# Altium schematic sheet STM32_SWD.SchDoc
size A4; SheetNumber: 7; SheetTotal: 8
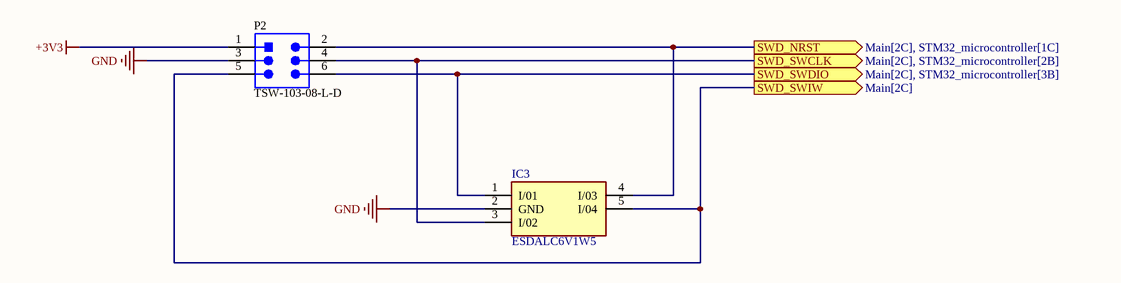
[diagram p0: STM32_SWD.SchDoc]

## Parts
IC3  ESDALC6V1W5  [SOT65P210X110-5N]
P2  TSW-103-08-L-D  [SMTC-TSW-103-08-L-D_V]

## Ports
SWD_NRST (out, see Main[2C], STM32_microcontroller[1C]), SWD_SWCLK (out, see Main[2C], STM32_microcontroller[2B]), SWD_SWDIO (out, see Main[2C], STM32_microcontroller[3B]), SWD_SWIW (out, see Main[2C])

## Nets
+3V3: P2.1
GND: IC3.2(GND) P2.3
SWD_NRST: IC3.4(I/03) P2.2 ; port SWD_NRST
SWD_SWCLK: IC3.3(I/02) P2.4 ; port SWD_SWCLK
SWD_SWDIO: IC3.1(I/01) P2.6 ; port SWD_SWDIO
SWD_SWIW: IC3.5(I/04) P2.5 ; port SWD_SWIW

## Library data of the parts
IC3 = ESDALC6V1W5: Integrated Circuit; Manufacturer_Name: STMicroelectronics; Datasheet Link: http://www.st.com/web/en/resource/technical/document/datasheet/CD00002946.pdf; Height: 1.1mm; Manufacturer_Part_Number: ESDALC6V1W5; Mouser Part Number: 511-ESDALC6V1W5; Mouser Price/Stock: https://www.mouser.co.uk/ProductDetail/STMicroelectronics/ESDALC6V1W5?qs=C%2FEejvvdwQ4xcyFnfrFaDw%3D%3D; Arrow Part Number: ESDALC6V1W5; Arrow Price/Stock: https://www.arrow.com/en/products/esdalc6v1w5/stmicroelectronics?utm_currency=USD&region=nac
P2 = CMP-1024-00336-5: Male Header, Pitch 2.54 mm, 2 x 3 Position, Height 8.38 mm, Tail Length 5.08 mm, -55 to 125 degC, RoHS, Bulk; Manufacturer: Samtec; DatasheetVersion: 04/2012; ComponentLink3URL: http://suddendocs.samtec.com/prints/tsw-xxx-xx-x-x-xx-xxx-footprint.pdf; PackageReference: TSW-103-08-L-D; Mounting Technology: Through Hole; Min Operating Temperature: -55 degC; ComponentLink2Description: Datasheet; Lead Pitch: 2.54 mm; ComponentLink1Description: Manufacturer URL; Mount: Through Hole; ComponentLink1URL: http://www.samtec.com/; ComponentLink3Description: Package Specification; Max Operating Temperature: 125 degC; PackageDescription: Male Header, Pitch 2.54 mm, 2 x 3 Position, Height 8.38 mm, Tail Length 5.08 mm; ComponentLink2URL: https://datasheet.ciiva.com/25618/0900766b81154476-25618436.pdf; RoHSCompliant: true